# Altium schematic sheet Power.SchDoc: PCB-Tester Power
size A4; Date: JUN 2020; CheckedBy: Moerz, Hoeren; Author: Rudziński; CompanyName: TDK-Micronas GmbH; DrawnBy: Rudziński; Engineer: Rudziński; Organization: Test Engineering; Address1: Hans-Bunte-Strasse 19; Address2: D-79108 Freiburg; Address3: Germany; DocumentNumber: U33110; Revision: V1.0; SheetNumber: 14; SheetTotal: 20; DateDraw: JUN 2020; DateChecked: 2020-06-19; Workspace: Workspace; TitleTyp: Title-Typ; PageSetup: Record=PageOptions|CenterHorizontal=True|CenterVertical=True|PrintScale=0.97|XCorrection=1.00|YCorrection=1.00|PrintKind=0|BorderSize=5000000|LeftOffset=0|BottomOffset=0|Orientation=2|PaperLength=1000|PaperWidth=1000|Scale=100|PaperSource=7|PrintQuality=-3|MediaType=1|DitherType=10|PrintScaleMode=1|PaperKind=A4|PaperIndex=9
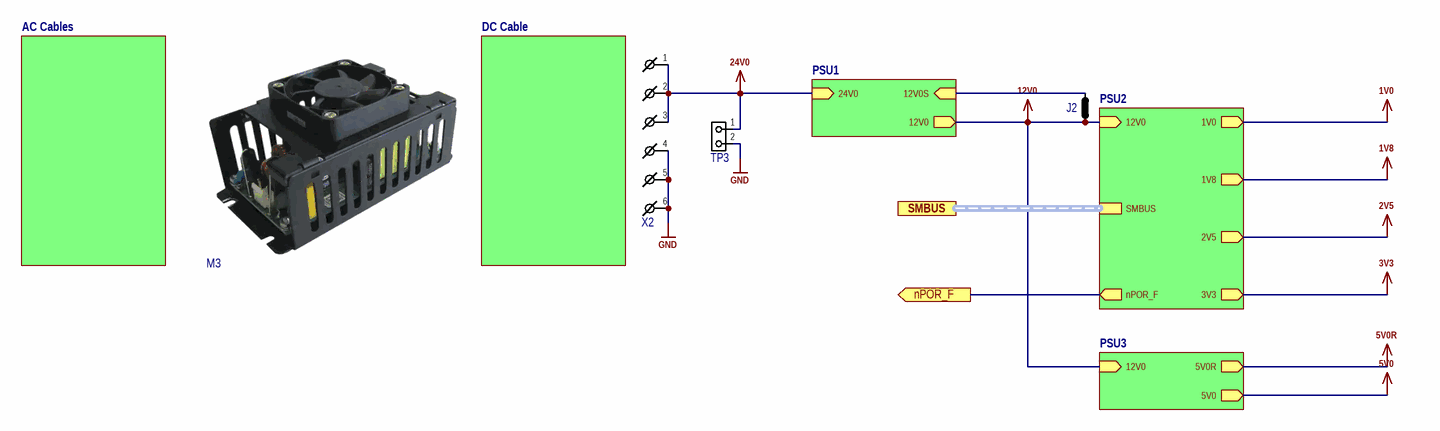
[diagram p0: Power.SchDoc]

## Parts
J2  J  [NT0201]  (value not drawn)  (net tie, no BOM)
M3  CUS150M-24/F  (value not drawn)
TP3  TP  [DualTestpoint 100mils]  (value not drawn)  (no BOM)
X2  X  [B6PS-VH]  (value not drawn)

## Sub-sheets
AC Cables = AC-Cable.SchDoc: no entries
DC Cable = DC-Cable.SchDoc: no entries
PSU1 = PSU1.SchDoc: 12V0 (out), 12V0S (in), 24V0 (in)
PSU2 = PSU2.SchDoc: 12V0 (in), 3V3 (out), 1V0 (out), 1V8 (out), 2V5 (out), SMBUS (harness SMBUS), nPOR_F (out)
PSU3 = PSU3.SchDoc: 12V0 (in), 5V0R (out), 5V0 (out)

## Ports
nPOR_F (out), SMBUS (harness SMBUS)

## Nets
1V0: sheet PSU2/1V0
1V8: sheet PSU2/1V8
2V5: sheet PSU2/2V5
3V3: sheet PSU2/3V3
5V0: sheet PSU3/5V0
5V0R: sheet PSU3/5V0R
12V0: J2.1 ; sheet PSU2/12V0, sheet PSU1/12V0, sheet PSU3/12V0
24V0: TP3.1 X2.1 X2.2 X2.3 ; sheet PSU1/24V0
GND: TP3.2 X2.4 X2.5 X2.6
nPOR_F: port nPOR_F, sheet PSU2/nPOR_F
NetJ2_2: J2.2 ; sheet PSU1/12V0S

## Buses and harness runs
harness port SMBUS = sheet PSU2/SMBUS

## Notes on the sheet
- designed by
- reviewed by
- last drawn by
- Project:
- Schematic:
- last printed
- DIN-A4 L
- sheets
- of
- File:

## Library data of the parts
J2 = NT: Net Tie; 13. Created Date/Name: AUG2018/Hören; 01. Distributor: N/A; 02. Distributor Part Number: N/A; 03. Unit Price: N/A; 04. Manufacturer: N/A; 05. Quantity: N/A; 06. Data Sheet: N/A; 07. Manufacturer  Part Number: N/A; 08. Inhouse Stock: N/A; 09. Operating Temperature: N/A; 10. Weight: N/A; 11. RoHS: N/A; 12.UL94 Flammability: N/A; ComponentLink1Description: Info; ComponentLink2Description: DataSheet
M3 = CUS150M-24/F: AC DC CONVERTER 85~264VAC --> 24VDC (6A); 04. Manufacturer: TDK-Lambda Americas Inc.; 07. Manufacturer  Part Number: CUS150M24/F; 03. Unit Price: 87.85; 13. Created Date/Name: AUG 2018 / Hören; 01. Distributor: DigiKey; 02. Distributor Part Number: 285-3030-ND; 09. Operating Temperature: -20°C ~ 85°C; 11. RoHS: YES; ComponentLink1Description: Info; ComponentLink1URL: https://www.digikey.de/product-detail/en/tdk-lambda-americas-inc/CUS150M24-F/285-3030-ND/7695382?cur=EUR&lang=en; ComponentLink2Description: DataSheet; ComponentLink2URL: https://product.tdk.com/info/en/catalog/datasheets/cus150m_e.pdf
TP3 = DualTestpoint 100mils: Dual testpoint, pitch 2.54mm; 04. Manufacturer: Samtec Inc.; 07. Manufacturer  Part Number: HMTSW-103-07-G-S-240; 03. Unit Price: 0.25; 13. Created Date/Name: AUG2018/Hören; 01. Distributor: Samtec Inc.; 02. Distributor Part Number: HMTSW-103-07-G-S-240; 11. RoHS: YES; ComponentLink1Description: Info; ComponentLink1URL: https://www.samtec.com/products/hmtsw-103-07-g-s-240; ComponentLink2Description: DataSheet; ComponentLink2URL: http://suddendocs.samtec.com/catalog_english/hmtsw.pdf
X2 = B6PS-VH: CONN HEADER R/A 6POS 3.96MM; 04. Manufacturer: JST Sales America Inc.; 07. Manufacturer  Part Number: B6PS-VH(LF)(SN); 03. Unit Price: 0.38; 13. Created Date/Name: AUG 2018 / Hören; System: Connector; 01. Distributor: DigiKey; 02. Distributor Part Number: 455-1652-ND; 09. Operating Temperature: -25°C ~ 85°C; 11. RoHS: YES; ComponentLink1Description: Info; ComponentLink1URL: https://www.digikey.de/product-detail/en/jst-sales-america-inc/B6PS-VH-LF-SN/455-1652-ND/926559; ComponentLink2Description: DataSheet; ComponentLink2URL: http://www.jst-mfg.com/product/pdf/eng/eVH.pdf